# Altium schematic sheet ORing.SchDoc
size A4; SheetNumber: 2; SheetTotal: 5
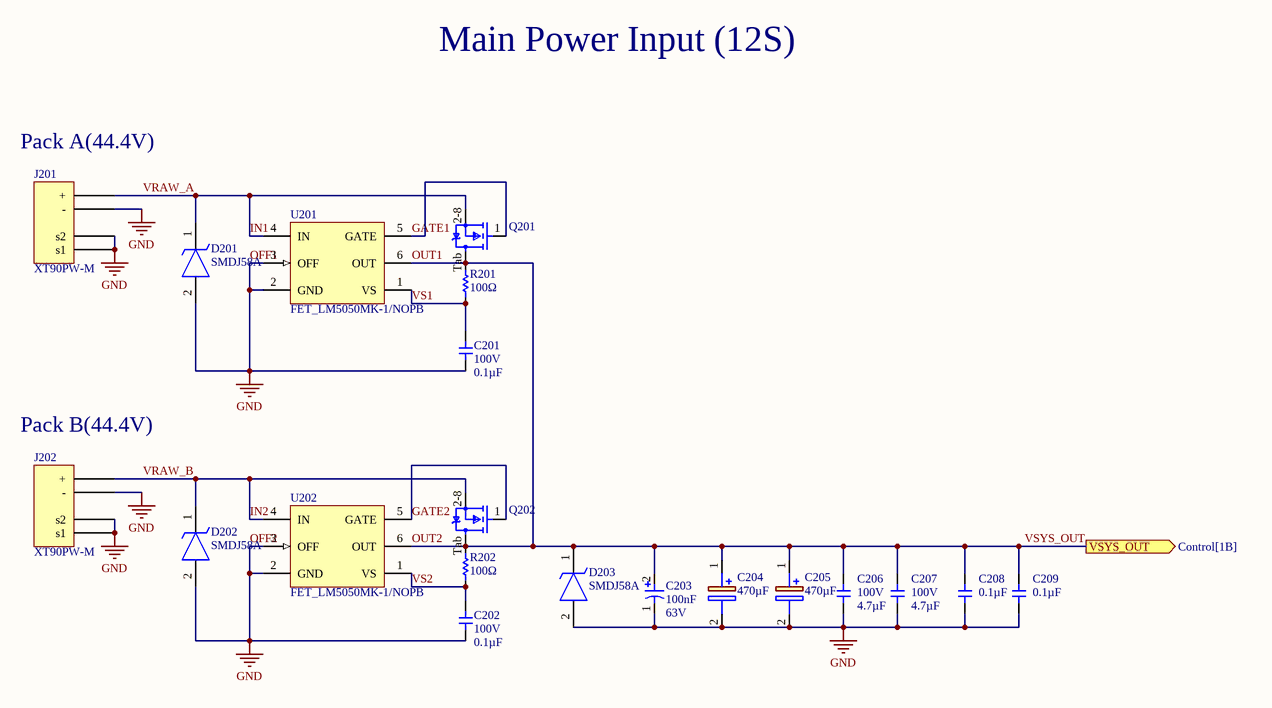
[diagram p0: ORing.SchDoc]

## Parts
C201  Voltage: 100V  Capacitance: 0.1µF  [1206]  (hidden comment: non-polar_Capacitor)
C202  Voltage: 100V  Capacitance: 0.1µF  [1206]  (hidden comment: non-polar_Capacitor)
C203  Capacitance: 100nF  Voltage: 63V  [SMD_Capacitor_tantal]  (hidden comment: Capacitor_tantal)
C204  470µF  [CAPAE1900X2200N]
C205  470µF  [CAPAE1900X2200N]
C206  Voltage: 100V  Capacitance: 4.7µF  [1210]  (hidden comment: non-polar_Capacitor)
C207  Voltage: 100V  Capacitance: 4.7µF  [1210]  (hidden comment: non-polar_Capacitor)
C208  Capacitance: 0.1µF  [0603]  (hidden comment: non-polar_Capacitor)
C209  Capacitance: 0.1µF  [0603]  (hidden comment: non-polar_Capacitor)
D201  SMDJ58A  [DIONM7959X262N]
D202  SMDJ58A  [DIONM7959X262N]
D203  SMDJ58A  [DIONM7959X262N]
J201  XT90PW-M  [AMASS_XT90PW-M]
J202  XT90PW-M  [AMASS_XT90PW-M]
Q201  Trans_Infineon_IPT015N10N5_eec  [Infineon_IPT015N10N5_0]  (value not drawn)
Q202  Trans_Infineon_IPT015N10N5_eec  [Infineon_IPT015N10N5_0]  (value not drawn)
R201  Resistance: 100Ω  [0603]  (hidden comment: Resistor)
R202  Resistance: 100Ω  [0603]  (hidden comment: Resistor)
U201  FET_LM5050MK-1/NOPB  [DDC0006A_M]
U202  FET_LM5050MK-1/NOPB  [DDC0006A_M]

## Ports
VSYS_OUT (out, see Control[1B])

## Nets
OFF1: C201.1 C202.1 C203.1 C204.2(-) C205.2(-) C206.2 C207.1 C208.1 C209.1 D201.2(A) D202.2(A) D203.2(A) J201.N(-) J201.S1(s1) J201.S2(s2) J202.N(-) J202.S1(s1) J202.S2(s2) U201.2(GND) U201.3(OFF) U202.2(GND) U202.3(OFF)  [also labelled GND, OFF2]
GATE1: Q201.1(Gate) U201.5(GATE)
GATE2: Q202.1(Gate) U202.5(GATE)
IN1: D201.1(K) J201.P(+) Q201.2-8(Source) U201.4(IN)  [also labelled VRAW_A]
IN2: D202.1(K) J202.P(+) Q202.2-8(Source) U202.4(IN)  [also labelled VRAW_B]
OUT1: C203.2 C204.1(+) C205.1(+) C206.1 C207.2 C208.2 C209.2 D203.1(K) Q201.Tab(Drain) Q202.Tab(Drain) R201.2 R202.2 U201.6(OUT) U202.6(OUT) ; port VSYS_OUT  [also labelled OUT2, VSYS_OUT]
VS1: C201.2 R201.1 U201.1(VS)
VS2: C202.2 R202.1 U202.1(VS)

## Notes on the sheet
- Main Power Input (12S)
- (near J201) Pack A(44.4V)
- (near J202) Pack B(44.4V)

## Library data of the parts
C201 C202 = CMP-024-000020-15: SMD type ceramic capacitor; Design Item ID: Capacitor; Source: robit_passive.SchLib
C203 = CMP-024-000021-5: SMD type tantalum capacitor; Design Item ID: Capacitor_tantal; Source: robit_passive.SchLib
C204 C205 = MAL215099913E3: Capacitor Polarised; Manufacturer_Name: Vishay; Datasheet Link: https://www.vishay.com/docs/28395/150crz.pdf; Height: 22mm; Manufacturer_Part_Number: MAL215099913E3; Mouser Part Number: 594-MAL215099913E3; Mouser Price/Stock: https://www.mouser.co.uk/ProductDetail/Vishay-BC-Components/MAL215099913E3?qs=bKenfurwlsm0xND%252Ba3hAeg%3D%3D; Arrow Part Number: MAL215099913E3; Arrow Price/Stock: null?region=nac
C206 C207 = CMP-024-000020-16: SMD type ceramic capacitor; Source: robit_passive.SchLib; Design Item ID: Capacitor
C208 C209 = CMP-024-000020-16: SMD type ceramic capacitor; Voltage: 100V; Source: robit_passive.SchLib; Design Item ID: Capacitor
D201-D203 = SMDJ58A: TVS Diode (Uni-directional); Manufacturer_Name: LITTELFUSE; Datasheet Link: https://mouser.componentsearchengine.com/Datasheets/2/SMDJ58A.pdf; Height: 2.62mm; Manufacturer_Part_Number: SMDJ58A; Mouser Part Number: 576-SMDJ58A; Mouser Price/Stock: https://www.mouser.co.uk/ProductDetail/Littelfuse/SMDJ58A?qs=zL8PTTxXkF2zAaoXCy3ytQ%3D%3D; Arrow Part Number: SMDJ58A; Arrow Price/Stock: https://www.arrow.com/en/products/smdj58a/littelfuse?utm_currency=USD&region=nac
J201 J202 = CMP-019-000092-5: Socket; DC supply; XT90; male; PIN: 2; on PCBs; THT; Colour: yellow; MF: AMASS; System: Connector; SnapEDA_Link: https://www.snapeda.com/parts/XT90PW-M/AMASS/view-part/?ref=snap; Package: Package; Source: XT90PW-M.SchLib; Check_prices: https://www.snapeda.com/parts/XT90PW-M/AMASS/view-part/?ref=eda; Value: *; Design Item ID: XT90PW-M; Pin Count: 2; MP: XT90PW-M; Component Type: Standard
Q201 Q202 = Trans_Infineon_IPT015N10N5_eec: TRANS MOSFET N-CH 100V 300A 8HSOF; Part Number: IPT015N10N5; helpURL: https://upverter.com/upn/revision/59ddb1136ed40b7f/; ComponentLink2Description: Datasheet; Temperature: -55°C to +175°C; Package: HSOF8; Supplier 2: Mouser; Supplier 1: Digi-Key; ComponentLink1URL: https://upverter.com/upn/revision/59ddb1136ed40b7f/; Supplier Part Number 2: 726-IPT015N10N5ATMA1; Supplier Part Number 1: IPT015N10N5ATMA1CT-ND; Manufacturer: Infineon; ComponentLink1Description: Upverter; ComponentLink2URL: http://www.infineon.com/dgdl/Infineon-IPT015N10N5-DS-v02_02-EN.pdf?fileId=5546d4624a75e5f1014ac94680661aff; RoHS: TRUE; Mouser Part Number: 726-IPT015N10N5ATMA1; Temperature Range High: +175°C; Digikey Description: TRANS MOSFET N-CH 100V 300A 8HSOF; Digikey Part Number: IPT015N10N5ATMA1CT-ND; Lead Free: yes; Temperature Range Low: -55°C
R201 R202 = CMP-029-000004-8: SMD type resistor; Design Item ID: Resistor; Source: robit_passive.SchLib
U201 U202 = CMP-026-000034-1: 5-V to 75-V 400-uA IQ ORing FET controller 6-SOT-23-THIN -40 to 125